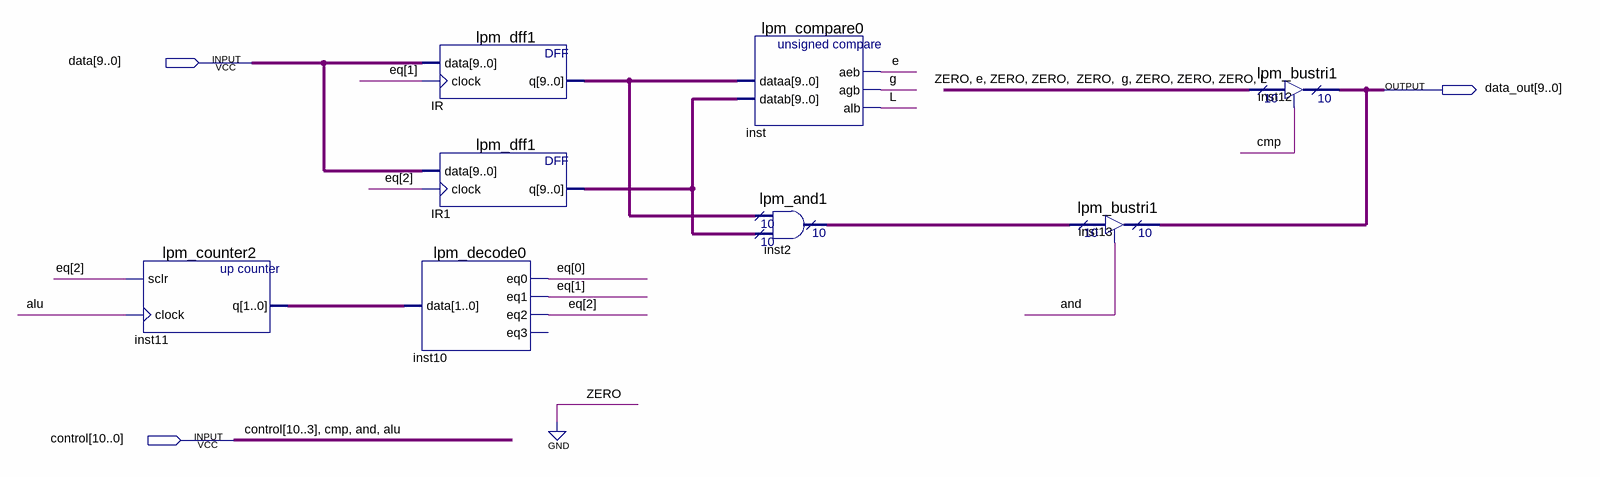
[diagram p0: schematic sheet]
// Quartus schematic alu.bdf as structural Verilog: 8 symbols, 3 pins
module alu (
  input  [9:0] data,
  input  [10:0] control,
  output [9:0] data_out
);

  wire e, g, L;
  wire [1:0] inst11_q;
  wire [2:0] eq;
  wire [9:0] inst2_result, IR1_q, IR_q;

  lpm_counter2 inst11 (.sclr(eq[2]), .clock(control[0]), .q(inst11_q));
  lpm_dff1 IR (.data(data), .clock(eq[1]), .q(IR_q));
  lpm_dff1 IR1 (.data(data), .clock(eq[2]), .q(IR1_q));
  lpm_decode0 inst10 (.data(inst11_q), .eq0(eq[0]), .eq1(eq[1]), .eq2(eq[2]));  // open: eq3
  lpm_compare0 inst (.dataa(IR_q), .datab(IR1_q), .aeb(e), .agb(g), .alb(L));
  lpm_and1 inst2 (.data0x(IR_q), .data1x(IR1_q), .result(inst2_result));
  lpm_bustri1 inst13 (.enabledt(control[1]), .data(inst2_result), .tridata(data_out));
  lpm_bustri1 inst12 (.enabledt(control[2]), .data({1'b0, e, 3'b000, g, 3'b000, L}), .tridata(data_out));

  // Other names for the same wires on the sheet: alu = control[0]; and = control[1]; cmp = control[2]
endmodule
